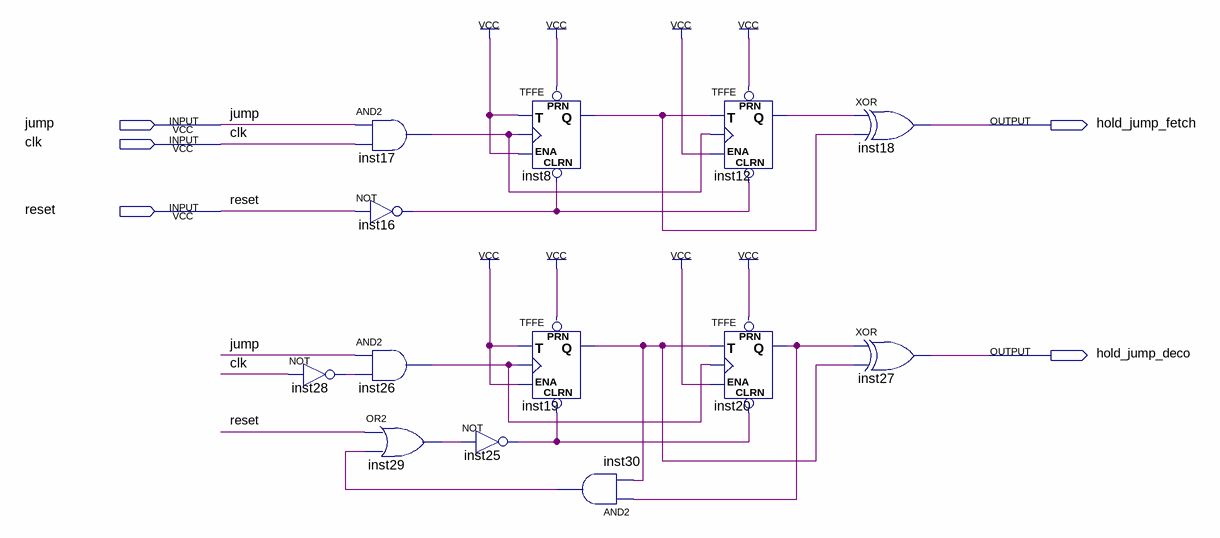
[diagram p0: schematic sheet]
// Quartus schematic uc_conditional_jump.bdf as structural Verilog: 13 symbols, 5 pins
module uc_conditional_jump (
  input  jump,
  input  clk,
  input  reset,
  output hold_jump_fetch,
  output hold_jump_deco
);

  wire inst8_q, inst12_q, inst16_out, inst17_out, inst19_q, inst20_q, inst25_out, inst26_out, inst28_out,
       inst29_out, inst30_out;

  not inst28 (inst28_out, clk);
  and inst17 (inst17_out, jump, clk);
  not inst16 (inst16_out, reset);
  and inst26 (inst26_out, jump, inst28_out);
  or inst29 (inst29_out, reset, inst30_out);
  not inst25 (inst25_out, inst29_out);
  TFFE inst8 (.CLRN(inst16_out), .T(1'b1), .CLK(inst17_out), .ENA(1'b1), .PRN(1'b1), .Q(inst8_q));
  TFFE inst19 (.CLRN(inst25_out), .T(1'b1), .CLK(inst26_out), .ENA(1'b1), .PRN(1'b1), .Q(inst19_q));
  and inst30 (inst30_out, inst20_q, inst19_q);
  TFFE inst12 (.CLRN(inst16_out), .T(inst8_q), .CLK(inst17_out), .ENA(1'b1), .PRN(1'b1), .Q(inst12_q));
  TFFE inst20 (.CLRN(inst25_out), .T(inst19_q), .CLK(inst26_out), .ENA(1'b1), .PRN(1'b1), .Q(inst20_q));
  xor inst18 (hold_jump_fetch, inst12_q, inst8_q);
  xor inst27 (hold_jump_deco, inst20_q, inst19_q);
endmodule
